# Altium project Lab STEPS PCB FINAL.PrjPcb
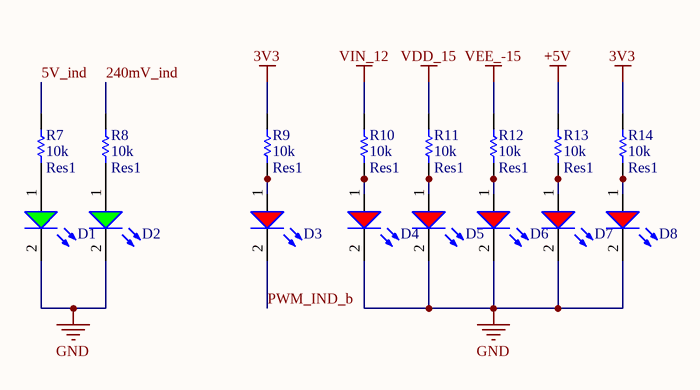
[diagram p0: connectors_headers_LEDs.SchDoc]
12 sheets, 128 parts. Net scope: global (net labels, ports and power ports of the same name join across sheets).
Board files: OnePieceBoard.PcbDoc, OnePieceBoard_kkk.PcbDoc
Sheets:
  connectors_headers_LEDs.SchDoc
  pwm_buffers_fault_sig.SchDoc
  current_signal_adaptation.SchDoc
  current_signal_adaptation_2.SchDoc
  current_signal_adaptation_3.SchDoc
  Connector 1.SchDoc
  Connector 2.SchDoc
  Comparator.SchDoc
  Supplies.SchDoc
  PWM Drivers.SchDoc
  vdc_signal_adaptation.SchDoc
  Header.SchDoc

## Sheet connectors_headers_LEDs.SchDoc
size A4; SheetNumber: 1; SheetTotal: 10; SPICEModelCacheXOLYCZGQ: <root> / <DocumentId>XOLYCZGQ</DocumentId> / <CacheFrame Number="0"> / <Model Name="3mm_151031vs04000" Kind="CKT"> / <Text>****** / .subckt 3mm_151031VS04000  1  2 / D1 1 2 TMRC / .MODEL TMRC D / + IS=10.010E-21 / + N=1.9467 / + RS=1.0000E-6 / + IKF=16.664E-3 / + CJO=1.0000E-12 / + M=.3333 / + VJ=.75 / + BV=5 / + IBV=10.00E-6 / + TT=5.0000E-9 / .ends</Text> / </Model> / <Model Name="3mm_151031ss04000" Kind="CKT"> / <Text>************************************************** / * Manufacturer:           Wurth Elektronik / * Kinds:                  THT Mono-color Round Color / * Matchcode:              WL-TMRC / * Library Type:           LTspice / * Version:                rev22a / * Created/modified by:    Ella / * Date and Time:          2022-02-23 / * Team:                   eiSos EDA Service / * Contact:                libraries@we-online.com / ************************************************** / * Copyright(C) 2022 WÃ¼rth Elektronik eiSos GmbH &amp; Co. KG / * All Rights Reserved. / ************************************************** / * Disclaimer: While WÃ¼rth Elektronik eiSos has made every reasonable effort to ensure the accuracy / * of the simulation models provided, WÃ¼rth Elektronik eiSos does not guarantee the exemption of error on / * the simulation models, nor does WÃ¼rth Elektronik eiSos guarantee that the simulation model is current. / * WÃ¼rth Elektronik eiSos reserves the right to make any adjustments at any time without notice. / * WÃ¼rth Elektronik eiSos expressly disclaims all implied warranties regarding this simulation model. / ************************************************** / .subckt 3mm_151031SS04000  1  2 / D1 1 2 TMRC / .MODEL TMRC D / + IS=10.010E-21 / + N=1.8860 / + RS=1.0000E-6 / + IKF=1.0000E3 / + CJO=1.0000E-12 / + M=.3333 / + VJ=.75 / + BV=5 / + IBV=10.00E-6 / + TT=5.0000E-9 / .ends</Text> / </Model> / </CacheFrame> / </root>

### Parts
D1  Bright Green, 2.1V, 40°  [WL-TMRC_D3.95H5.3]  (value not drawn)
D2  Bright Green, 2.1V, 40°  [WL-TMRC_D3.95H5.3]  (value not drawn)
D3  Super Red, 2V, 40°  [WL-TMRC_D3.95H5.3]  (value not drawn)
D4  Super Red, 2V, 40°  [WL-TMRC_D3.95H5.3]  (value not drawn)
D5  Super Red, 2V, 40°  [WL-TMRC_D3.95H5.3]  (value not drawn)
D6  Super Red, 2V, 40°  [WL-TMRC_D3.95H5.3]  (value not drawn)
D7  Super Red, 2V, 40°  [WL-TMRC_D3.95H5.3]  (value not drawn)
D8  Super Red, 2V, 40°  [WL-TMRC_D3.95H5.3]  (value not drawn)
R7  Res1  value 10k  [AXIAL-0.4]
R8  Res1  value 10k  [AXIAL-0.4]
R9  Res1  value 10k  [AXIAL-0.4]
R10  Res1  value 10k  [AXIAL-0.4]
R11  Res1  value 10k  [AXIAL-0.4]
R12  Res1  value 10k  [AXIAL-0.4]
R13  Res1  value 10k  [AXIAL-0.4]
R14  Res1  value 10k  [AXIAL-0.4]

### Nets
3V3: R9.2 R14.2
+5V: R13.2
GND: D1.2(K) D2.2(K) D4.2(K) D5.2(K) D6.2(K) D7.2(K) D8.2(K)
VDD_15: R11.2
VEE_-15: R12.2
VIN_12: R10.2
5V_ind: R7.2
240mV_ind: R8.2
PWM_IND_b: D3.2(K)
NetD1_1: D1.1(A) R7.1
NetD2_1: D2.1(A) R8.1
NetD3_1: D3.1(A) R9.1
NetD4_1: D4.1(A) R10.1
NetD5_1: D5.1(A) R11.1
NetD6_1: D6.1(A) R12.1
NetD7_1: D7.1(A) R13.1
NetD8_1: D8.1(A) R14.1

### Library data of the parts
D1 D2 = 151031VS04000: WL-TMRC Mono-color Round Color, THT, D3.95 x H5.3mm, Bright Green, 2.1V, 40°; Manufacturer: Wurth Elektronik; Case/Size Code: 3mm; Chip Technology: AlInGaP; Dominant Wavelength: 570nm; Luminous Intensity: 120mcd; Peak Wavelength: 573nm; Manufacturer Part Number: 151031VS04000; Category: Signal LEDs; Match Code: WL-TMRC; ComponentLink1Description: Website Link; ComponentLink1URL: https://www.we-online.com/redexpert/article/151031VS04000?ad; ComponentLink2Description: Datasheet Link; ComponentLink2URL: https://www.we-online.com/redexpert/spec/151031VS04000?ad; Mount: Through Hole; Operating Temperature Max: 85°C; Operating Temperature Min: -40°C; Packaging: Bulk; Height: 5.3mm; Diameter: 3.95mm; Emitting Color: Bright Green; Forward Voltage: 2.1V; Viewing Angle: 40°
D3-D8 = 151031SS04000: WL-TMRC Mono-color Round Color, THT, D3.95 x H5.3mm, Super Red, 2V, 40°; Manufacturer: Wurth Elektronik; Case/Size Code: 3mm; Chip Technology: AlInGaP; Dominant Wavelength: 635nm; Luminous Intensity: 160mcd; Peak Wavelength: 640nm; Manufacturer Part Number: 151031SS04000; Category: Signal LEDs; Match Code: WL-TMRC; ComponentLink1Description: Website Link; ComponentLink1URL: https://www.we-online.com/redexpert/article/151031SS04000?ad; ComponentLink2Description: Datasheet Link; ComponentLink2URL: https://www.we-online.com/redexpert/spec/151031SS04000?ad; Mount: Through Hole; Operating Temperature Max: 85°C; Operating Temperature Min: -40°C; Packaging: Bulk; Height: 5.3mm; Diameter: 3.95mm; Emitting Color: Super Red; Forward Voltage: 2V; Viewing Angle: 40°
R7-R14 = Res1: Resistor; Published: 8-Jun-2000; LatestRevisionDate: 17-Jul-2002; LatestRevisionNote: Re-released for DXP Platform.; PackageReference: AXIAL-0.3; Publisher: Altium Limited; PackageDescription: Axial Device, Thru-Hole; 2 Leads; 0.3 in Pin Spacing

## Sheet pwm_buffers_fault_sig.SchDoc
size A4; SheetNumber: 2; SheetTotal: 11; SPICEModelCacheDVQRIBGN: <root> / <DocumentId>DVQRIBGN</DocumentId> / <CacheFrame Number="0"> / <Model Name="3mm_151031ss04000" Kind="CKT"> / <Text>************************************************** / * Manufacturer:           Wurth Elektronik / * Kinds:                  THT Mono-color Round Color / * Matchcode:              WL-TMRC / * Library Type:           LTspice / * Version:                rev22a / * Created/modified by:    Ella / * Date and Time:          2022-02-23 / * Team:                   eiSos EDA Service / * Contact:                libraries@we-online.com / ************************************************** / * Copyright(C) 2022 WÃ¼rth Elektronik eiSos GmbH &amp; Co. KG / * All Rights Reserved. / ************************************************** / * Disclaimer: While WÃ¼rth Elektronik eiSos has made every reasonable effort to ensure the accuracy / * of the simulation models provided, WÃ¼rth Elektronik eiSos does not guarantee the exemption of error on / * the simulation models, nor does WÃ¼rth Elektronik eiSos guarantee that the simulation model is current. / * WÃ¼rth Elektronik eiSos reserves the right to make any adjustments at any time without notice. / * WÃ¼rth Elektronik eiSos expressly disclaims all implied warranties regarding this simulation model. / ************************************************** / .subckt 3mm_151031SS04000  1  2 / D1 1 2 TMRC / .MODEL TMRC D / + IS=10.010E-21 / + N=1.8860 / + RS=1.0000E-6 / + IKF=1.0000E3 / + CJO=1.0000E-12 / + M=.3333 / + VJ=.75 / + BV=5 / + IBV=10.00E-6 / + TT=5.0000E-9 / .ends</Text> / </Model> / </CacheFrame> / </root>
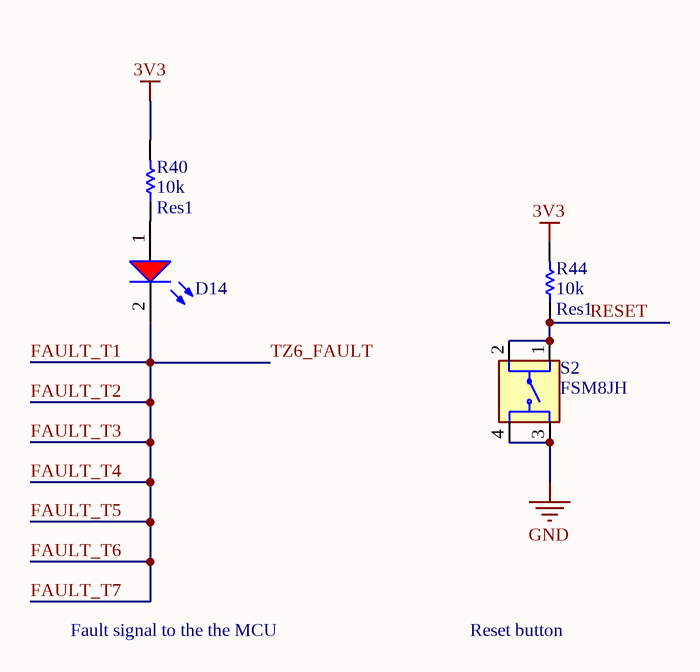
[diagram p1: pwm_buffers_fault_sig.SchDoc]

### Parts
D14  Super Red, 2V, 40°  [WL-TMRC_D3.95H5.3]  (value not drawn)
R40  Res1  value 10k  [AXIAL-0.4]
R44  Res1  value 10k  [AXIAL-0.4]
S2  FSM8JH  [SW_FSM8JH]

### Nets
3V3: R40.2 R44.2
GND: S2.3 S2.4
FAULT_T1: D14.2(K)  [also labelled FAULT_T2, FAULT_T3, FAULT_T4, FAULT_T5, FAULT_T6, FAULT_T7, TZ6_FAULT]
RESET: R44.1 S2.1 S2.2
NetD14_1: D14.1(A) R40.1

### Notes on the sheet
- Fault signal to the the MCU
- Reset button

### Library data of the parts
D14 = 151031SS04000: as D3 on sheet connectors_headers_LEDs; Manufacturer Part Number: 151031SS04000; Category: Signal LEDs; Match Code: WL-TMRC; ComponentLink1Description: Website Link; ComponentLink1URL: https://www.we-online.com/redexpert/article/151031SS04000?ad; ComponentLink2Description: Datasheet Link; ComponentLink2URL: https://www.we-online.com/redexpert/spec/151031SS04000?ad; Mount: Through Hole; Operating Temperature Max: 85°C; Operating Temperature Min: -40°C; Packaging: Bulk; Height: 5.3mm; Diameter: 3.95mm; Emitting Color: Super Red; Forward Voltage: 2V; Viewing Angle: 40°
R40 R44 = Res1: Resistor; Published: 8-Jun-2000; LatestRevisionDate: 17-Jul-2002; LatestRevisionNote: Re-released for DXP Platform.; PackageReference: AXIAL-0.3; Publisher: Altium Limited; PackageDescription: Axial Device, Thru-Hole; 2 Leads; 0.3 in Pin Spacing
S2 = FSM8JH: Tactile Switch SPST-NO Top Actuated Through Hole; MF: TE Connectivity; Check_prices: https://www.snapeda.com/parts/FSM8JH/TE+Connectivity+ALCOSWITCH+Switches/view-part/?ref=eda; Value: *; Availability: In Stock; MP: FSM8JH; Price: None; Package: None; SnapEDA_Link: https://www.snapeda.com/parts/FSM8JH/TE+Connectivity+ALCOSWITCH+Switches/view-part/?ref=snap

## Sheet current_signal_adaptation.SchDoc
size A4; SheetNumber: 3; SheetTotal: 12
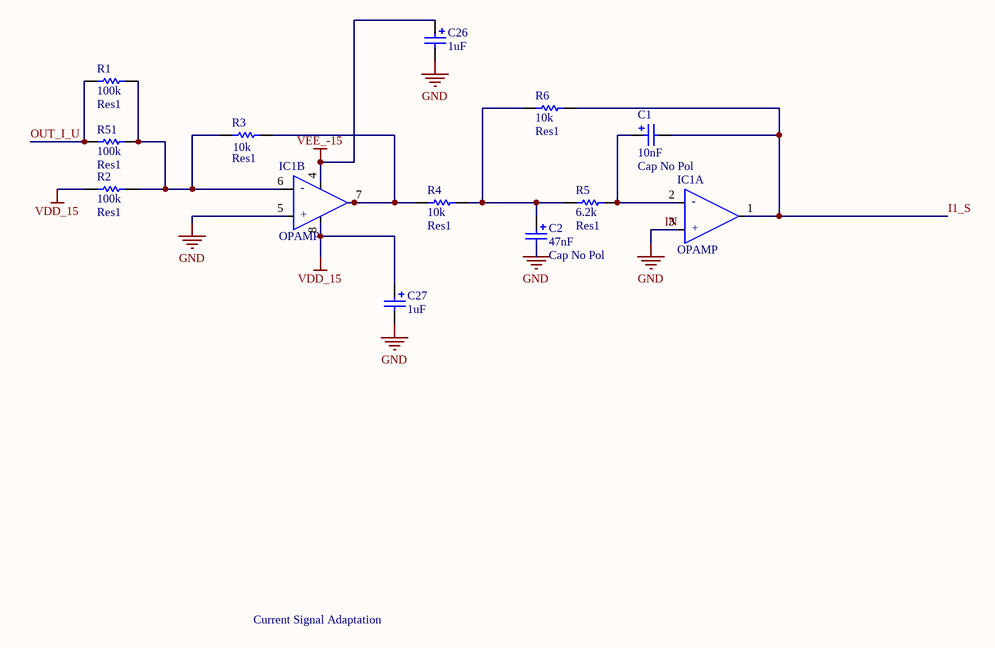
[diagram p2: current_signal_adaptation.SchDoc]

### Parts
C1  Cap No Pol  value 10nF  [RAD-0.1]
C2  Cap No Pol  value 47nF  [RAD-0.1]
C26  value 1uF  [RAD-0.1]  (hidden comment: Cap No Pol)
C27  value 1uF  [RAD-0.1]  (hidden comment: Cap No Pol)
IC1  OPAMP  [DIP-8]  (parts A,B of 2)
R1  Res1  value 100k  [AXIAL-0.4]
R2  Res1  value 100k  [AXIAL-0.4]
R3  Res1  value 10k  [AXIAL-0.4]
R4  Res1  value 10k  [AXIAL-0.4]
R5  Res1  value 6.2k  [AXIAL-0.4]
R6  Res1  value 10k  [AXIAL-0.4]
R51  Res1  value 100k  [AXIAL-0.4]

### Nets
GND: C2.2 C26.2 C27.2 IC1.3(IN_A_+) IC1.5(IN_B_+)  [also labelled IN]
VDD_15: C27.1 IC1.8(V+) R2.1
VEE_-15: C26.1 IC1.4(-V)
I1_S: C1.2 IC1.1(OUT_A) R6.2
OUT_I_U: R1.1 R51.1
NetC1_1: C1.1 IC1.2(IN_A_-) R5.2
NetC2_1: C2.1 R4.2 R5.1 R6.1
NetIC1_7: IC1.7(OUT_B) R3.2 R4.1
NetR1_2: R1.2 R2.2 R3.1 R51.2

Not connected (* = marked no-connect by the designer): IC1 6(IN_B_-)

### Notes on the sheet
- Current Signal Adaptation
- (in symbol ADTL082, part A) -; +
- (in symbol ADTL082, part B) -; +

### Library data of the parts
C1 C2 C26 C27 = Cap No Pol: Polarized Capacitor (Radial); Published: 8-Jun-2000; LatestRevisionDate: 17-Jul-2002; LatestRevisionNote: Re-released for DXP Platform.; PackageReference: RB7.6-15; Publisher: Altium Limited; PackageDescription: Polarized Capacitor (Radial); 2 Leads
IC1 = ADTL082
R1-R6 R51 = Res1: Resistor; Published: 8-Jun-2000; LatestRevisionDate: 17-Jul-2002; LatestRevisionNote: Re-released for DXP Platform.; PackageReference: AXIAL-0.3; Publisher: Altium Limited; PackageDescription: Axial Device, Thru-Hole; 2 Leads; 0.3 in Pin Spacing

## Sheet current_signal_adaptation_2.SchDoc
size A4; SheetNumber: 4; SheetTotal: 12
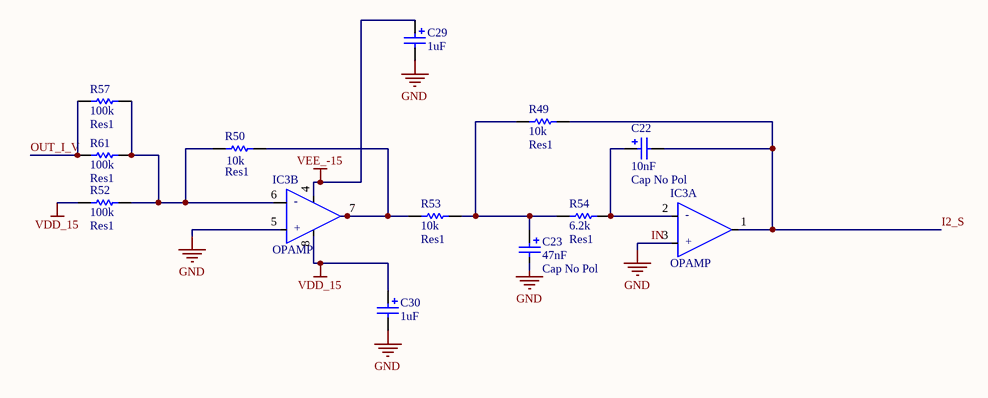
[diagram p3: current_signal_adaptation_2.SchDoc]

### Parts
C22  Cap No Pol  value 10nF  [RAD-0.1]
C23  Cap No Pol  value 47nF  [RAD-0.1]
C29  value 1uF  [RAD-0.1]  (hidden comment: Cap No Pol)
C30  value 1uF  [RAD-0.1]  (hidden comment: Cap No Pol)
IC3  OPAMP  [DIP-8]  (parts A,B of 2)
R49  Res1  value 10k  [AXIAL-0.4]
R50  Res1  value 10k  [AXIAL-0.4]
R52  Res1  value 100k  [AXIAL-0.4]
R53  Res1  value 10k  [AXIAL-0.4]
R54  Res1  value 6.2k  [AXIAL-0.4]
R57  Res1  value 100k  [AXIAL-0.4]
R61  Res1  value 100k  [AXIAL-0.4]

### Nets
GND: C23.2 C29.2 C30.2 IC3.3(IN_A_+) IC3.5(IN_B_+)  [also labelled IN]
VDD_15: C30.1 IC3.8(V+) R52.1
VEE_-15: C29.1 IC3.4(-V)
I2_S: C22.2 IC3.1(OUT_A) R49.2
OUT_I_V: R57.1 R61.1
NetC22_1: C22.1 IC3.2(IN_A_-) R54.2
NetC23_1: C23.1 R49.1 R53.2 R54.1
NetIC3_7: IC3.7(OUT_B) R50.2 R53.1
NetR50_1: R50.1 R52.2 R57.2 R61.2

Not connected (* = marked no-connect by the designer): IC3 6(IN_B_-)

### Notes on the sheet
- (in symbol ADTL082, part A) -; +
- (in symbol ADTL082, part B) -; +

### Library data of the parts
C22 C23 C29 C30 = Cap No Pol: Polarized Capacitor (Radial); Published: 8-Jun-2000; LatestRevisionDate: 17-Jul-2002; LatestRevisionNote: Re-released for DXP Platform.; PackageReference: RB7.6-15; Publisher: Altium Limited; PackageDescription: Polarized Capacitor (Radial); 2 Leads
IC3 = ADTL082
R49 R50 R52-R54 R57 R61 = Res1: Resistor; Published: 8-Jun-2000; LatestRevisionDate: 17-Jul-2002; LatestRevisionNote: Re-released for DXP Platform.; PackageReference: AXIAL-0.3; Publisher: Altium Limited; PackageDescription: Axial Device, Thru-Hole; 2 Leads; 0.3 in Pin Spacing

## Sheet current_signal_adaptation_3.SchDoc
size A4; SheetNumber: 5; SheetTotal: 12
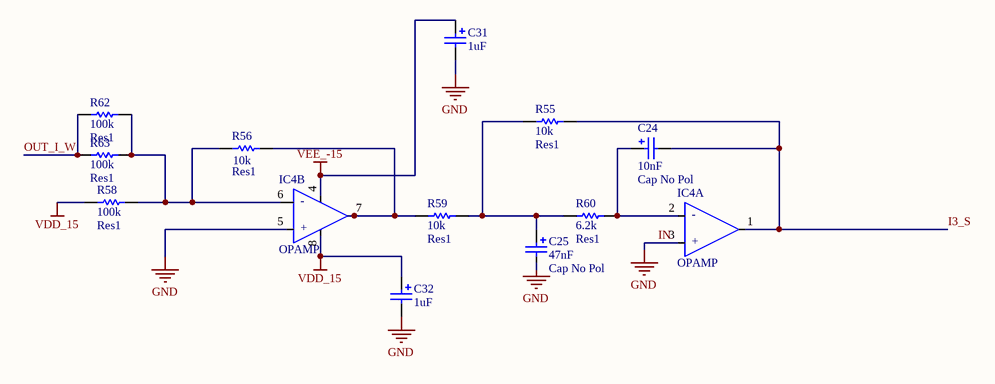
[diagram p4: current_signal_adaptation_3.SchDoc]

### Parts
C24  Cap No Pol  value 10nF  [RAD-0.1]
C25  Cap No Pol  value 47nF  [RAD-0.1]
C31  value 1uF  [RAD-0.1]  (hidden comment: Cap No Pol)
C32  value 1uF  [RAD-0.1]  (hidden comment: Cap No Pol)
IC4  OPAMP  [DIP-8]  (parts A,B of 2)
R55  Res1  value 10k  [AXIAL-0.4]
R56  Res1  value 10k  [AXIAL-0.4]
R58  Res1  value 100k  [AXIAL-0.4]
R59  Res1  value 10k  [AXIAL-0.4]
R60  Res1  value 6.2k  [AXIAL-0.4]
R62  Res1  value 100k  [AXIAL-0.4]
R63  Res1  value 100k  [AXIAL-0.4]

### Nets
GND: C25.2 C31.2 C32.2 IC4.3(IN_A_+) IC4.5(IN_B_+)  [also labelled IN]
VDD_15: C32.1 IC4.8(V+) R58.1
VEE_-15: C31.1 IC4.4(-V)
I3_S: C24.2 IC4.1(OUT_A) R55.2
OUT_I_W: R62.1 R63.1
NetC24_1: C24.1 IC4.2(IN_A_-) R60.2
NetC25_1: C25.1 R55.1 R59.2 R60.1
NetIC4_7: IC4.7(OUT_B) R56.2 R59.1
NetR56_1: R56.1 R58.2 R62.2 R63.2

Not connected (* = marked no-connect by the designer): IC4 6(IN_B_-)

### Notes on the sheet
- (in symbol ADTL082, part A) -; +
- (in symbol ADTL082, part B) -; +

### Library data of the parts
C24 C25 C31 C32 = Cap No Pol: Polarized Capacitor (Radial); Published: 8-Jun-2000; LatestRevisionDate: 17-Jul-2002; LatestRevisionNote: Re-released for DXP Platform.; PackageReference: RB7.6-15; Publisher: Altium Limited; PackageDescription: Polarized Capacitor (Radial); 2 Leads
IC4 = ADTL082
R55 R56 R58-R60 R62 R63 = Res1: Resistor; Published: 8-Jun-2000; LatestRevisionDate: 17-Jul-2002; LatestRevisionNote: Re-released for DXP Platform.; PackageReference: AXIAL-0.3; Publisher: Altium Limited; PackageDescription: Axial Device, Thru-Hole; 2 Leads; 0.3 in Pin Spacing

## Sheet Connector 1.SchDoc
size A4; SheetNumber: 6; SheetTotal: 12
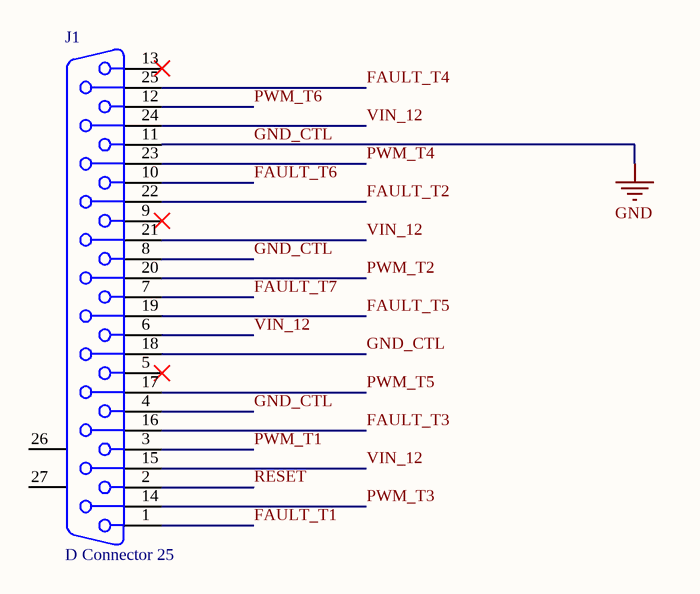
[diagram p5: Connector 1.SchDoc]

### Parts
J1  D Connector 25  [DSUB1.385-2H25A]

### Nets
GND: J1.4 J1.8 J1.11 J1.18  [also labelled GND_CTL]
VIN_12: J1.6 J1.15 J1.21 J1.24
FAULT_T1: J1.1 J1.7 J1.10 J1.16 J1.19 J1.22 J1.25  [also labelled FAULT_T2, FAULT_T3, FAULT_T4, FAULT_T5, FAULT_T6, FAULT_T7]
PWM_T1: J1.3
PWM_T2: J1.20
PWM_T3: J1.14
PWM_T4: J1.23
PWM_T5: J1.17
PWM_T6: J1.12
RESET: J1.2

Not connected (* = marked no-connect by the designer): J1 5* 9* 13* 26(MH1) 27(MH2)

### Library data of the parts
J1 = D Connector 25: Receptacle Assembly, 25 Position, Right Angle; PackageDocument: U; Positions: 25; Published: 15-Jun-2001; LatestRevisionDate: 17-Jul-2002; LatestRevisionNote: Re-released for DXP Platform.; DatasheetDocument: 19-Mar-1999; PackageReference: 787202; Publisher: Altium Limited; Orientation: Right Angle; Gender: Receptacle

## Sheet Connector 2.SchDoc
size A4; SheetNumber: 7; SheetTotal: 12
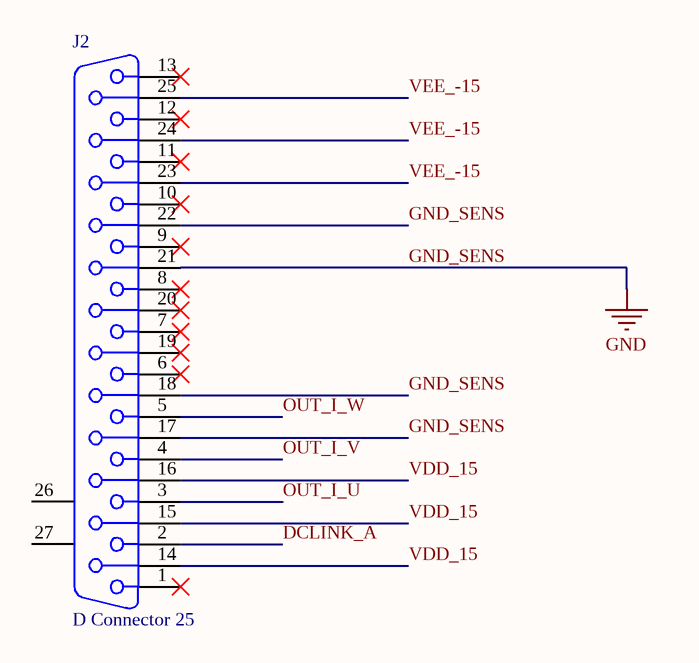
[diagram p6: Connector 2.SchDoc]

### Parts
J2  D Connector 25  [DSUB1.385-2H25A]

### Nets
GND: J2.17 J2.18 J2.21 J2.22  [also labelled GND_SENS]
VDD_15: J2.14 J2.15 J2.16
VEE_-15: J2.23 J2.24 J2.25
DCLINK_A: J2.2
OUT_I_U: J2.3
OUT_I_V: J2.4
OUT_I_W: J2.5

Not connected (* = marked no-connect by the designer): J2 1* 6* 7* 8* 9* 10* 11* 12* 13* 19* 20* 26(MH1) 27(MH2)

### Library data of the parts
J2 = D Connector 25: as J1 on sheet Connector 1; Published: 15-Jun-2001; LatestRevisionDate: 17-Jul-2002; LatestRevisionNote: Re-released for DXP Platform.; DatasheetDocument: 19-Mar-1999; PackageReference: 787202; Publisher: Altium Limited; Orientation: Right Angle; Gender: Receptacle

## Sheet Comparator.SchDoc
size A4; SheetNumber: 8; SheetTotal: 10; SPICEModelCacheRNZNTXQS: <root> / <DocumentId>RNZNTXQS</DocumentId> / <CacheFrame Number="0"> / <Model Name="1n4001" Kind="MDL"> / <Text>*1N4001 MCE 8-16-95 / *50V 1A Si GenPurpose Diode pkg:DIODE0.4 1,2 / .MODEL 1N4001 D(IS=2.55E-9 RS=0.042 N=1.75 TT=5.76E-6 CJO=1.85E-11 / + VJ=0.75 M=0.333 BV=50 IBV=1E-5 )</Text> / </Model> / </CacheFrame> / </root>
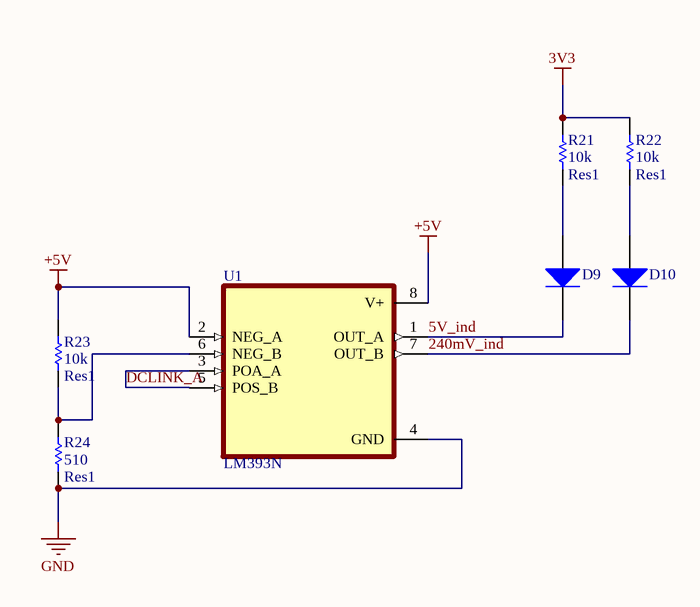
[diagram p7: Comparator.SchDoc]

### Parts
D9  Diode 1N4001  [DO-41]  (value not drawn)
D10  Diode 1N4001  [DO-41]  (value not drawn)
R21  Res1  value 10k  [AXIAL-0.4]
R22  Res1  value 10k  [AXIAL-0.4]
R23  Res1  value 10k  [AXIAL-0.4]
R24  Res1  value 510  [AXIAL-0.4]
U1  LM393N  [DIP794W45P254L959H508Q8]

### Nets
3V3: R21.2 R22.2
+5V: R23.2 U1.2(NEG_A) U1.8(V+)
GND: R24.1 U1.4(GND)
5V_ind: D9.2(K) U1.1(OUT_A)
240mV_ind: D10.2(K) U1.7(OUT_B)
DCLINK_A: U1.3(POA_A) U1.5(POS_B)
NetD9_1: D9.1(A) R21.1
NetD10_1: D10.1(A) R22.1
NetR23_1: R23.1 R24.2 U1.6(NEG_B)

### Library data of the parts
D9 D10 = Diode 1N4001: 1 Amp General Purpose Rectifier; Published: 8-Jun-2000; LatestRevisionDate: 17-Jul-2002; LatestRevisionNote: Re-released for DXP Platform.; DatasheetVersion: 1998; PackageVersion: Aug-1999; PackageReference: DO-41; Publisher: Altium Limited; PackageDescription: Diode, Axial; Body 5.2 x 2.7 mm (LxDia. max), Lead Dia. 0.86 mm (max); Code_JEDEC: DO-204-AL; ComponentLink1Description: Manufacturer Link; ComponentLink1URL: http://www.fairchildsemi.com/; ComponentLink2Description: Datasheet; ComponentLink2URL: http://www.fairchildsemi.com/ds/1N%2F1N4001.pdf
R21-R24 = Res1: Resistor; Published: 8-Jun-2000; LatestRevisionDate: 17-Jul-2002; LatestRevisionNote: Re-released for DXP Platform.; PackageReference: AXIAL-0.3; Publisher: Altium Limited; PackageDescription: Axial Device, Thru-Hole; 2 Leads; 0.3 in Pin Spacing
U1 = LM393N: Low Power Low Offset Voltage Dual Comparator 8-PDIP 0 to 70; MF: Texas Instruments; MP: LM393N/NOPB; Digi-Key_Part_Number: LM393NNS/NOPB-ND; Mouser-Purchase-URL: https://snapeda.com/shop?store=Mouser&id=67776; SnapEDA_Link: https://www.snapeda.com/parts/LM393N/NOPB/Texas%20Instruments/view-part/67776/?ref=snap; Texas_Instruments-Purchase-URL: https://snapeda.com/shop?store=Texas+Instruments&id=67776; Value: *; Package: PDIP-8 Texas Instruments; DigiKey-Purchase-URL: https://snapeda.com/shop?store=DigiKey&id=67776; BuyPart: https://www.snapeda.com/parts/LM393N/NOPB/Texas%20Instruments/view-part/67776/?ref=eda

## Sheet Supplies.SchDoc
size A4; SheetNumber: 9; SheetTotal: 10; SPICEModelCacheEZLPWFQN: <root> / <DocumentId>EZLPWFQN</DocumentId> / <CacheFrame Number="0"> / <Model Name="1n4001" Kind="MDL"> / <Text>*1N4001 MCE 8-16-95 / *50V 1A Si GenPurpose Diode pkg:DIODE0.4 1,2 / .MODEL 1N4001 D(IS=2.55E-9 RS=0.042 N=1.75 TT=5.76E-6 CJO=1.85E-11 / + VJ=0.75 M=0.333 BV=50 IBV=1E-5 )</Text> / </Model> / </CacheFrame> / </root>
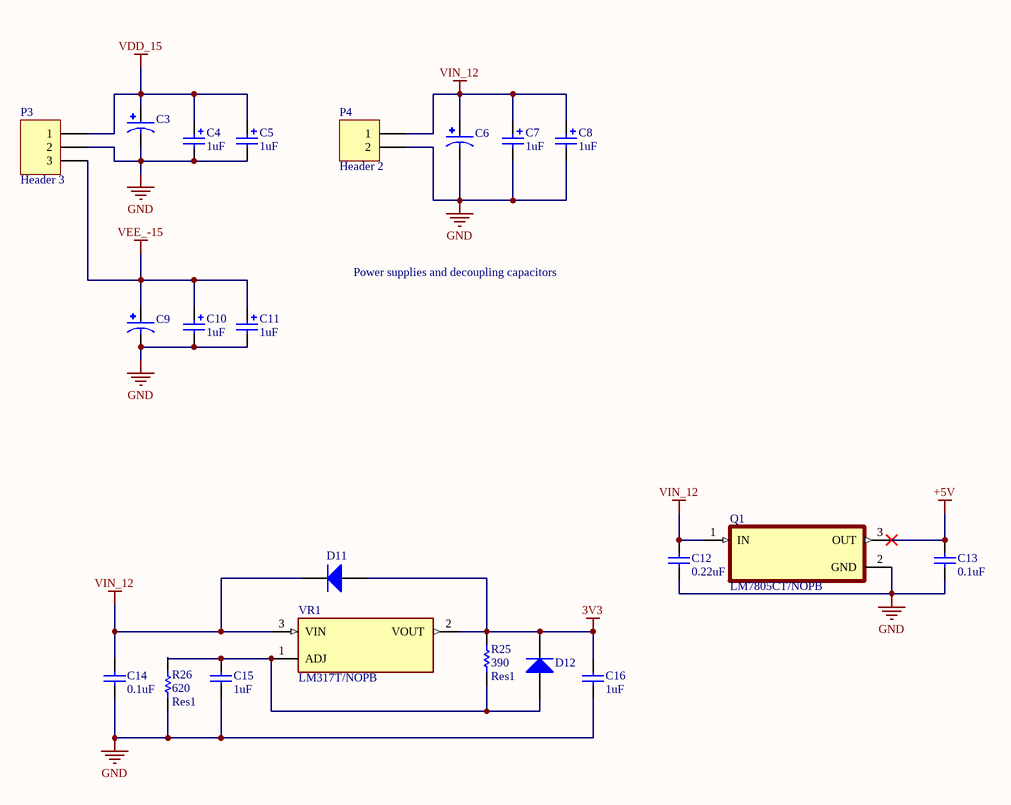
[diagram p8: Supplies.SchDoc]

### Parts
C3  ECA2AM100B  [CAPPRD500W50D500H1100]  (value not drawn)
C4  value 1uF  [RAD-0.1]  (hidden comment: Cap No Pol)
C5  value 1uF  [RAD-0.1]  (hidden comment: Cap No Pol)
C6  ECA2AM100B  [CAPPRD500W50D500H1100]  (value not drawn)
C7  value 1uF  [RAD-0.1]  (hidden comment: Cap No Pol)
C8  value 1uF  [RAD-0.1]  (hidden comment: Cap No Pol)
C9  ECA2AM100B  [CAPPRD500W50D500H1100]  (value not drawn)
C10  value 1uF  [RAD-0.1]  (hidden comment: Cap No Pol)
C11  value 1uF  [RAD-0.1]  (hidden comment: Cap No Pol)
C12  value 0.22uF  [RAD-0.3]  (hidden comment: Cap)
C13  value 0.1uF  [RAD-0.3]  (hidden comment: Cap)
C14  value 0.1uF  [RAD-0.3]  (hidden comment: Cap)
C15  value 1uF  [RAD-0.3]  (hidden comment: Cap)
C16  value 1uF  [RAD-0.3]  (hidden comment: Cap)
D11  Diode 1N4001  [DO-41]  (value not drawn)
D12  Diode 1N4001  [DO-41]  (value not drawn)
P3  Header 3  [HDR1X3]
P4  Header 2  [HDR1X2]
Q1  LM7805CT/NOPB  [TO254P1054X470X1955-3]
R25  Res1  value 390  [AXIAL-0.4]
R26  Res1  value 620  [AXIAL-0.4]
VR1  LM317T/NOPB  [TO254P1054X470X1955-3]

### Nets
3V3: C16.1 D11.1(A) D12.2(K) R25.2 VR1.2(VOUT)
+5V: C13.1 Q1.3(OUT)
GND: C3.N C4.2 C5.2 C6.N C7.2 C8.2 C9.N C10.2 C11.2 C12.2 C13.2 C14.2 C15.2 C16.2 P3.2 P4.2 Q1.2(GND) R26.1
VDD_15: C3.P C4.1 C5.1 P3.1
VEE_-15: C9.P C10.1 C11.1 P3.3
VIN_12: C6.P C7.1 C8.1 C12.1 C14.1 D11.2(K) P4.1 Q1.1(IN) VR1.3(VIN)
NetC15_1: C15.1 D12.1(A) R25.1 R26.2 VR1.1(ADJ)

### Notes on the sheet
- Power supplies and decoupling capacitors

### Library data of the parts
C3 C6 C9 = ECA2AM100B: 10ÂµF 100V Aluminum Electrolytic Capacitors Radial, Can 2000 Hrs @ 85Â°C; MF: Panasonic; Value: *; Package: RADIAL-2 Panasonic; Check_prices: https://www.snapeda.com/parts/ECA2AM100B/Panasonic/view-part/?ref=eda; SnapEDA_Link: https://www.snapeda.com/parts/ECA2AM100B/Panasonic/view-part/?ref=snap; MP: ECA2AM100B; Digi-Key_Part_Number: P19556TB-ND
C4 C5 C7 C8 C10 C11 = Cap No Pol: Polarized Capacitor (Radial); Published: 8-Jun-2000; LatestRevisionDate: 17-Jul-2002; LatestRevisionNote: Re-released for DXP Platform.; PackageReference: RB7.6-15; Publisher: Altium Limited; PackageDescription: Polarized Capacitor (Radial); 2 Leads
C12-C16 = Cap: Capacitor; Published: 8-Jun-2000; LatestRevisionDate: 17-Jul-2002; LatestRevisionNote: Re-released for DXP Platform.; PackageReference: RAD-0.3; Publisher: Altium Limited; PackageDescription: Radial Cap, Thru-Hole; 2 Leads; 0.3 in Pin Spacing
D11 D12 = Diode 1N4001: 1 Amp General Purpose Rectifier; Published: 8-Jun-2000; LatestRevisionDate: 17-Jul-2002; LatestRevisionNote: Re-released for DXP Platform.; DatasheetVersion: 1998; PackageVersion: Aug-1999; PackageReference: DO-41; Publisher: Altium Limited; PackageDescription: Diode, Axial; Body 5.2 x 2.7 mm (LxDia. max), Lead Dia. 0.86 mm (max); Code_JEDEC: DO-204-AL; ComponentLink1Description: Manufacturer Link; ComponentLink1URL: http://www.fairchildsemi.com/; ComponentLink2Description: Datasheet; ComponentLink2URL: http://www.fairchildsemi.com/ds/1N%2F1N4001.pdf
P3 = Header 3: Header, 3-Pin; LatestRevisionDate: 17-Jul-2002; LatestRevisionNote: Re-released for DXP Platform.; Publisher: Altium Limited
P4 = Header 2: Header, 2-Pin; LatestRevisionDate: 17-Jul-2002; LatestRevisionNote: Re-released for DXP Platform.; Publisher: Altium Limited
R25 R26 = Res1: Resistor; Published: 8-Jun-2000; LatestRevisionDate: 17-Jul-2002; LatestRevisionNote: Re-released for DXP Platform.; PackageReference: AXIAL-0.3; Publisher: Altium Limited; PackageDescription: Axial Device, Thru-Hole; 2 Leads; 0.3 in Pin Spacing
VR1 = LM317T/NOPB: 1.5-A, 40-V, adjustable linear voltage regulator; MF: Texas Instruments; SnapEDA_Link: https://www.snapeda.com/parts/LM317T/NOPB/Texas+Instruments/view-part/?ref=snap; Package: TO-220-3 Texas Instruments; Value: *; MP: LM317T/NOPB; Check_prices: https://www.snapeda.com/parts/LM317T/NOPB/Texas+Instruments/view-part/?ref=eda
Q1 = LM7805CT/NOPB: Price: None; MP: LM7805CT/NOPB; Availability: Unavailable; Value: *; Package: None

## Sheet PWM Drivers.SchDoc
size A4; SheetNumber: 10; SheetTotal: 12
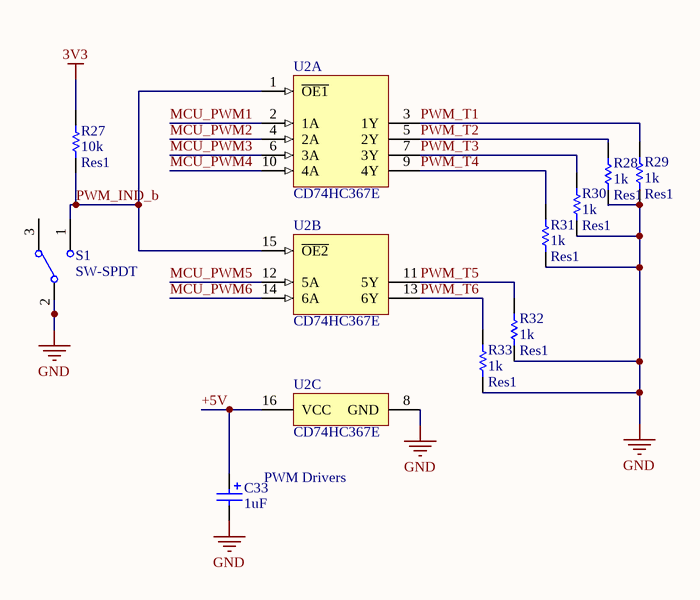
[diagram p9: PWM Drivers.SchDoc]

### Parts
C33  value 1uF  [RAD-0.1]  (hidden comment: Cap No Pol)
R27  Res1  value 10k  [AXIAL-0.4]
R28  Res1  value 1k  [AXIAL-0.4]
R29  Res1  value 1k  [AXIAL-0.4]
R30  Res1  value 1k  [AXIAL-0.4]
R31  Res1  value 1k  [AXIAL-0.4]
R32  Res1  value 1k  [AXIAL-0.4]
R33  Res1  value 1k  [AXIAL-0.4]
S1  SW-SPDT  [MHDR1X3]
U2  CD74HC367E  [N0016A]  (parts A,B,C of 3)

### Nets
3V3: R27.2
+5V: C33.1 U2.16(VCC)
GND: C33.2 R28.1 R29.1 R30.1 R31.1 R32.1 R33.1 S1.2 U2.8(GND)
MCU_PWM1: U2.2(1A)
MCU_PWM2: U2.4(2A)
MCU_PWM3: U2.6(3A)
MCU_PWM4: U2.10(4A)
MCU_PWM5: U2.12(5A)
MCU_PWM6: U2.14(6A)
PWM_IND_b: R27.1 S1.1 U2.1(~{OE1}) U2.15(~{OE2})
PWM_T1: R29.2 U2.3(1Y)
PWM_T2: R28.2 U2.5(2Y)
PWM_T3: R30.2 U2.7(3Y)
PWM_T4: R31.2 U2.9(4Y)
PWM_T5: R32.2 U2.11(5Y)
PWM_T6: R33.2 U2.13(6Y)

Not connected (* = marked no-connect by the designer): S1 3

### Notes on the sheet
- (near C33) PWM Drivers

### Library data of the parts
C33 = Cap No Pol: Polarized Capacitor (Radial); Published: 8-Jun-2000; LatestRevisionDate: 17-Jul-2002; LatestRevisionNote: Re-released for DXP Platform.; PackageReference: RB7.6-15; Publisher: Altium Limited; PackageDescription: Polarized Capacitor (Radial); 2 Leads
R27-R33 = Res1: Resistor; Published: 8-Jun-2000; LatestRevisionDate: 17-Jul-2002; LatestRevisionNote: Re-released for DXP Platform.; PackageReference: AXIAL-0.3; Publisher: Altium Limited; PackageDescription: Axial Device, Thru-Hole; 2 Leads; 0.3 in Pin Spacing
S1 = SW-SPDT: SPDT Subminiature Toggle Switch, Right Angle Mounting, Vertical Actuation; Published: 24-Mar-1999; LatestRevisionDate: 17-Dec-2003; LatestRevisionNote: Schematic revised, PCB Footprint replaced.; DatasheetVersion: 05-Dec-2000; PackageReference: TL36WW15050; Publisher: Altium Limited; PackageDescription: Switch; 4 Leads; ComponentLink1Description: Manufacturer Link; ComponentLink1URL: http://www.apem.com
U2 = CMP-0440-00947-3: High Speed CMOS Logic Hex Buffers/Line Drivers with Non-Inverting 3-State Outputs, N0016A, TUBE; Manufacturer: Texas Instruments; Voltage(Nom)(V): 6; VCC(Min)(V): 2; F @ Nom Voltage(Max)(Mhz): 28; ICC @ Nom Voltage(Max)(mA): 0.08; tpd @ Nom Voltage(Max)(ns): 24; Rating: Catalog; Operating Temperature Range(C): -55 to 125; Output Type: CMOS; DatasheetVersion: SCHS181D; Code_JEDEC: MS-001; PackageReference: N0016A; PackageVersion: http://www.ti.com/lit/ml/mpdi002c/mpdi002c.pdf; Generic Part Number: CD74HC367; Bits(#): 6; VCC(Max)(V): 6; Input Type: CMOS

## Sheet vdc_signal_adaptation.SchDoc
size A4; SheetNumber: 11; SheetTotal: 12
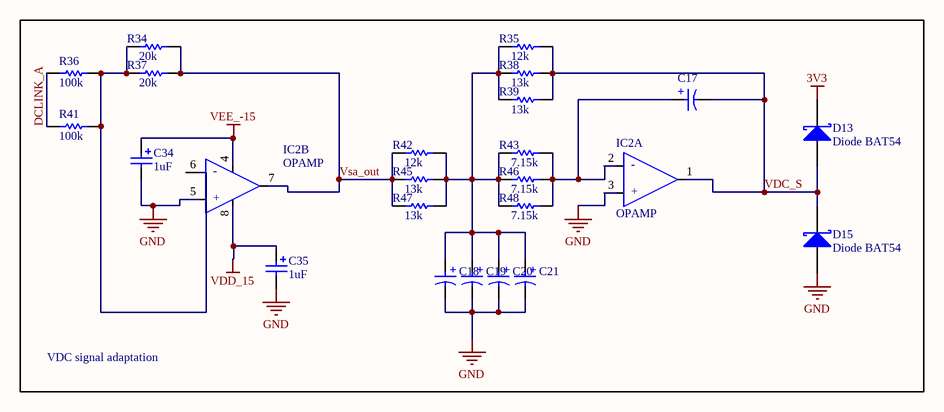
[diagram p10: vdc_signal_adaptation.SchDoc]

### Parts
C17  860020772005  [WCAP-ATG5_D5H11]  (value not drawn)
C18  860020772005  [WCAP-ATG5_D5H11]  (value not drawn)
C19  860020772005  [WCAP-ATG5_D5H11]  (value not drawn)
C20  860020772005  [WCAP-ATG5_D5H11]  (value not drawn)
C21  860020772005  [WCAP-ATG5_D5H11]  (value not drawn)
C34  value 1uF  [RAD-0.1]  (hidden comment: Cap No Pol)
C35  value 1uF  [RAD-0.1]  (hidden comment: Cap No Pol)
D13  Diode BAT54  [DO-204AL]
D15  Diode BAT54  [DO-204AL]
IC2  OPAMP  [DIP-8]  (parts A,B of 2)
R34  value 20k  [AXIAL-0.4]  (hidden comment: Res1)
R35  value 12k  [AXIAL-0.4]  (hidden comment: Res1)
R36  value 100k  [AXIAL-0.4]
R37  value 20k  [AXIAL-0.4]  (hidden comment: Res1)
R38  value 13k  [AXIAL-0.4]  (hidden comment: Res1)
R39  value 13k  [AXIAL-0.4]  (hidden comment: Res1)
R41  value 100k  [AXIAL-0.4]  (hidden comment: Res1)
R42  value 12k  [AXIAL-0.4]  (hidden comment: Res1)
R43  value 7.15k  [AXIAL-0.4]  (hidden comment: Res1)
R45  value 13k  [AXIAL-0.4]  (hidden comment: Res1)
R46  value 7.15k  [AXIAL-0.4]  (hidden comment: Res1)
R47  value 13k  [AXIAL-0.4]  (hidden comment: Res1)
R48  value 7.15k  [AXIAL-0.4]  (hidden comment: Res1)

### Blocks framed on the sheet
VDC signal adaptation: C17-C21 C34 C35 D13 D15 IC2 R34-R39 R41-R43 R45-R48

### Nets
3V3: D13.2(K)
GND: C18.2(N) C19.2(N) C20.2(N) C21.2(N) C34.2 C35.2 D15.1(A) IC2.3(IN_A_+) IC2.5(IN_B_+)
VDD_15: C35.1 IC2.8(V+)
VEE_-15: C34.1 IC2.4(-V)
DCLINK_A: R36.1 R41.1
VDC_S: C17.2(N) D13.1(A) D15.2(K) IC2.1(OUT_A) R35.2 R38.2 R39.2
Vsa_out: IC2.7(OUT_B) R34.2 R37.2 R42.1 R45.1 R47.1
NetC17_1: C17.1(P) IC2.2(IN_A_-) R43.2 R46.2 R48.2
NetC18_1: C18.1(P) C19.1(P) C20.1(P) C21.1(P) R35.1 R38.1 R39.1 R42.2 R43.1 R45.2 R46.1 R47.2 R48.1
NetIC2_6: IC2.6(IN_B_-) R34.1 R36.2 R37.1 R41.2

### Notes on the sheet
- (in symbol ADTL082, part A) -; +
- (in symbol ADTL082, part B) -; +
- (in symbol CMP-03913-53914248-1) +

### Library data of the parts
C17-C21 = CMP-03913-53914248-1: 860020772005 Cap Aluminum Lytic 1uF 63V 20% (5 X 11mm) Radial 2mm 13mA 2000h 105C; Life (Hours): 2000hours; Capacitance: 1µF; Material: Aluminium; Leakage Current: 3µA; Polarity: Polar; Voltage Rating: 63V; Tolerance: 20%; REACH SVHC: Unknown; Case/Package: Radial; NexarPartId: 53914248; Length: 11mm; Packaging: Tape & Box (TB); Pitch: 2mm; Ripple Current: 13mA; Height: 11mm; Height - Seated (Max): 12.4968mm; Max Operating Temperature: 105°C; Mount: Through Hole; Diameter: 5mm; RoHS: Compliant; Voltage Rating (DC): 63V; Lead Pitch: 2.0066mm; Min Operating Temperature: -40°C
C34 C35 = Cap No Pol: Polarized Capacitor (Radial); Published: 8-Jun-2000; LatestRevisionDate: 17-Jul-2002; LatestRevisionNote: Re-released for DXP Platform.; PackageReference: RB7.6-15; Publisher: Altium Limited; PackageDescription: Polarized Capacitor (Radial); 2 Leads
D13 D15 = Diode 11DQ03: Schottky Rectifier; Published: 8-Jun-2000; LatestRevisionDate: 17-Jul-2002; LatestRevisionNote: Re-released for DXP Platform.; DatasheetVersion: Dec-1997; PackageReference: DO-204AL; Publisher: Altium Limited; PackageDescription: Diode, Axial; Body 5.2 x 2.7 mm (LxDia. max), Lead Dia. 0.86 mm (max); Code_JEDEC: DO-204-AL; ComponentLink1Description: Manufacturer Link; ComponentLink1URL: http://www.irf.com/; ComponentLink2Description: Datasheet; ComponentLink2URL: http://www.irf.com/product-info/datasheets/data/11dq03.pdf
IC2 = ADTL082
R34-R39 R41-R43 R45-R48 = Res1: Resistor; Published: 8-Jun-2000; LatestRevisionDate: 17-Jul-2002; LatestRevisionNote: Re-released for DXP Platform.; PackageReference: AXIAL-0.3; Publisher: Altium Limited; PackageDescription: Axial Device, Thru-Hole; 2 Leads; 0.3 in Pin Spacing

## Sheet Header.SchDoc
size A4; SheetNumber: 12; SheetTotal: 12
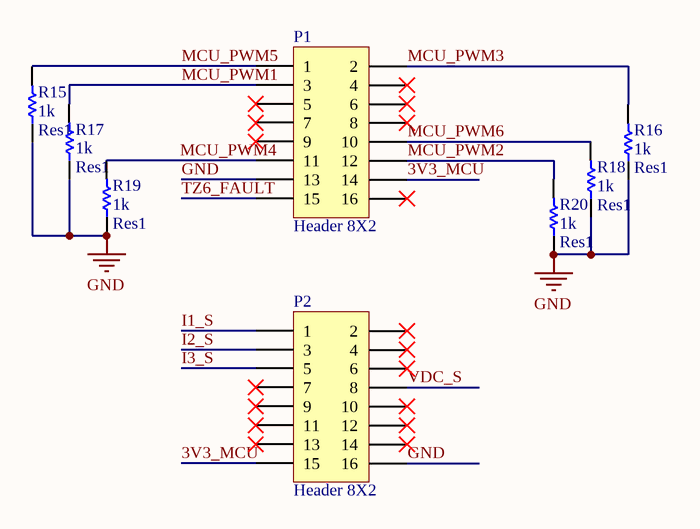
[diagram p11: Header.SchDoc]

### Parts
P1  Header 8X2  [HDR2X8]
P2  Header 8X2  [HDR2X8]
R15  Res1  value 1k  [AXIAL-0.4]
R16  Res1  value 1k  [AXIAL-0.4]
R17  Res1  value 1k  [AXIAL-0.4]
R18  Res1  value 1k  [AXIAL-0.4]
R19  Res1  value 1k  [AXIAL-0.4]
R20  Res1  value 1k  [AXIAL-0.4]

### Nets
GND: P1.13 P2.16 R15.1 R16.1 R17.1 R18.1 R19.1 R20.1
3V3_MCU: P1.14 P2.15
I1_S: P2.1
I2_S: P2.3
I3_S: P2.5
MCU_PWM1: P1.3 R17.2
MCU_PWM2: P1.12 R20.2
MCU_PWM3: P1.2 R16.2
MCU_PWM4: P1.11 R19.2
MCU_PWM5: P1.1 R15.2
MCU_PWM6: P1.10 R18.2
TZ6_FAULT: P1.15  [project net FAULT_T1]
VDC_S: P2.8

Not connected (* = marked no-connect by the designer): P1 4* 5* 6* 7* 8* 9* 16*; P2 2* 4* 6* 7* 9* 10* 11* 12* 13* 14*

### Library data of the parts
P1 P2 = Header 8X2: Header, 8-Pin, Dual row; LatestRevisionDate: 17-Jul-2002; LatestRevisionNote: Re-released for DXP Platform.; Publisher: Altium Limited
R15-R20 = Res1: Resistor; Published: 8-Jun-2000; LatestRevisionDate: 17-Jul-2002; LatestRevisionNote: Re-released for DXP Platform.; PackageReference: AXIAL-0.3; Publisher: Altium Limited; PackageDescription: Axial Device, Thru-Hole; 2 Leads; 0.3 in Pin Spacing

## Nets that join several sheets
3V3: connectors_headers_LEDs (R9.2 R14.2), pwm_buffers_fault_sig (R40.2 R44.2), Comparator (R21.2 R22.2), Supplies (5 pins), PWM Drivers (R27.2), vdc_signal_adaptation (D13.2)
+5V: connectors_headers_LEDs (R13.2), Comparator (R23.2 U1.2 U1.8), Supplies (C13.1 Q1.3), PWM Drivers (C33.1 U2.16)
GND: connectors_headers_LEDs (7 pins), pwm_buffers_fault_sig (S2.3 S2.4), current_signal_adaptation (5 pins), current_signal_adaptation_2 (5 pins), current_signal_adaptation_3 (5 pins), Connector 1 (J1.4 J1.8 J1.11 J1.18), Connector 2 (J2.17 J2.18 J2.21 J2.22), Comparator (R24.1 U1.4), Supplies (18 pins), PWM Drivers (9 pins), vdc_signal_adaptation (9 pins), Header (8 pins)
VDD_15: connectors_headers_LEDs (R11.2), current_signal_adaptation (C27.1 IC1.8 R2.1), current_signal_adaptation_2 (C30.1 IC3.8 R52.1), current_signal_adaptation_3 (C32.1 IC4.8 R58.1), Connector 2 (J2.14 J2.15 J2.16), Supplies (C3.P C4.1 C5.1 P3.1), vdc_signal_adaptation (C35.1 IC2.8)
VEE_-15: connectors_headers_LEDs (R12.2), current_signal_adaptation (C26.1 IC1.4), current_signal_adaptation_2 (C29.1 IC3.4), current_signal_adaptation_3 (C31.1 IC4.4), Connector 2 (J2.23 J2.24 J2.25), Supplies (C9.P C10.1 C11.1 P3.3), vdc_signal_adaptation (C34.1 IC2.4)
VIN_12: connectors_headers_LEDs (R10.2), Connector 1 (J1.6 J1.15 J1.21 J1.24), Supplies (9 pins)
5V_ind: connectors_headers_LEDs (R7.2), Comparator (D9.2 U1.1)
240mV_ind: connectors_headers_LEDs (R8.2), Comparator (D10.2 U1.7)
DCLINK_A: Connector 2 (J2.2), Comparator (U1.3 U1.5), vdc_signal_adaptation (R36.1 R41.1)
FAULT_T1: pwm_buffers_fault_sig (D14.2), Connector 1 (7 pins), Header (P1.15)
I1_S: current_signal_adaptation (C1.2 IC1.1 R6.2), Header (P2.1)
I2_S: current_signal_adaptation_2 (C22.2 IC3.1 R49.2), Header (P2.3)
I3_S: current_signal_adaptation_3 (C24.2 IC4.1 R55.2), Header (P2.5)
MCU_PWM1: PWM Drivers (U2.2), Header (P1.3 R17.2)
MCU_PWM2: PWM Drivers (U2.4), Header (P1.12 R20.2)
MCU_PWM3: PWM Drivers (U2.6), Header (P1.2 R16.2)
MCU_PWM4: PWM Drivers (U2.10), Header (P1.11 R19.2)
MCU_PWM5: PWM Drivers (U2.12), Header (P1.1 R15.2)
MCU_PWM6: PWM Drivers (U2.14), Header (P1.10 R18.2)
OUT_I_U: current_signal_adaptation (R1.1 R51.1), Connector 2 (J2.3)
OUT_I_V: current_signal_adaptation_2 (R57.1 R61.1), Connector 2 (J2.4)
OUT_I_W: current_signal_adaptation_3 (R62.1 R63.1), Connector 2 (J2.5)
PWM_IND_b: connectors_headers_LEDs (D3.2), PWM Drivers (R27.1 S1.1 U2.1 U2.15)
PWM_T1: Connector 1 (J1.3), PWM Drivers (R29.2 U2.3)
PWM_T2: Connector 1 (J1.20), PWM Drivers (R28.2 U2.5)
PWM_T3: Connector 1 (J1.14), PWM Drivers (R30.2 U2.7)
PWM_T4: Connector 1 (J1.23), PWM Drivers (R31.2 U2.9)
PWM_T5: Connector 1 (J1.17), PWM Drivers (R32.2 U2.11)
PWM_T6: Connector 1 (J1.12), PWM Drivers (R33.2 U2.13)
RESET: pwm_buffers_fault_sig (R44.1 S2.1 S2.2), Connector 1 (J1.2)
VDC_S: vdc_signal_adaptation (7 pins), Header (P2.8)